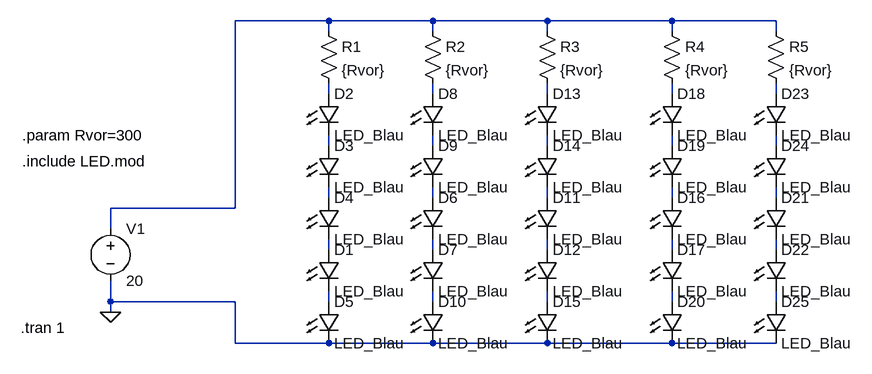
[diagram p0: schematic LED-Strip.asc]
LED-Strip.asc, the LTspice schematic file:
Version 4
SHEET 1 1132 680
WIRE 96 -192 -48 -192
WIRE 256 -192 96 -192
WIRE 432 -192 256 -192
WIRE 624 -192 432 -192
WIRE 784 -192 624 -192
WIRE 96 -176 96 -192
WIRE 256 -176 256 -192
WIRE 432 -176 432 -192
WIRE 624 -176 624 -192
WIRE 784 -176 784 -192
WIRE 96 -80 96 -96
WIRE 256 -80 256 -96
WIRE 432 -80 432 -96
WIRE 624 -80 624 -96
WIRE 784 -80 784 -96
WIRE 96 0 96 -16
WIRE 256 0 256 -16
WIRE 432 0 432 -16
WIRE 624 0 624 -16
WIRE 784 0 784 -16
WIRE 96 80 96 64
WIRE 256 80 256 64
WIRE 432 80 432 64
WIRE 624 80 624 64
WIRE 784 80 784 64
WIRE -48 96 -48 -192
WIRE -48 96 -240 96
WIRE -240 128 -240 96
WIRE 96 160 96 144
WIRE 256 160 256 144
WIRE 432 160 432 144
WIRE 624 160 624 144
WIRE 784 160 784 144
WIRE -240 240 -240 208
WIRE -48 240 -240 240
WIRE 96 240 96 224
WIRE 256 240 256 224
WIRE 432 240 432 224
WIRE 624 240 624 224
WIRE 784 240 784 224
WIRE -240 256 -240 240
WIRE -48 304 -48 240
WIRE 96 304 -48 304
WIRE 256 304 96 304
WIRE 432 304 256 304
WIRE 624 304 432 304
WIRE 784 304 624 304
FLAG -240 256 0
SYMBOL voltage -240 112 R0
WINDOW 123 0 0 Left 2
WINDOW 39 0 0 Left 2
SYMATTR InstName V1
SYMATTR Value 20
SYMBOL LED 80 80 R0
SYMATTR InstName D4
SYMATTR Value LED_Blau
SYMBOL LED 80 160 R0
SYMATTR InstName D1
SYMATTR Value LED_Blau
SYMBOL LED 80 -80 R0
SYMATTR InstName D2
SYMATTR Value LED_Blau
SYMBOL LED 80 0 R0
SYMATTR InstName D3
SYMATTR Value LED_Blau
SYMBOL LED 80 240 R0
SYMATTR InstName D5
SYMATTR Value LED_Blau
SYMBOL res 80 -192 R0
SYMATTR InstName R1
SYMATTR Value {Rvor}
SYMBOL LED 240 80 R0
SYMATTR InstName D6
SYMATTR Value LED_Blau
SYMBOL LED 240 160 R0
SYMATTR InstName D7
SYMATTR Value LED_Blau
SYMBOL LED 240 -80 R0
SYMATTR InstName D8
SYMATTR Value LED_Blau
SYMBOL LED 240 0 R0
SYMATTR InstName D9
SYMATTR Value LED_Blau
SYMBOL LED 240 240 R0
SYMATTR InstName D10
SYMATTR Value LED_Blau
SYMBOL res 240 -192 R0
SYMATTR InstName R2
SYMATTR Value {Rvor}
SYMBOL LED 416 80 R0
SYMATTR InstName D11
SYMATTR Value LED_Blau
SYMBOL LED 416 160 R0
SYMATTR InstName D12
SYMATTR Value LED_Blau
SYMBOL LED 416 -80 R0
SYMATTR InstName D13
SYMATTR Value LED_Blau
SYMBOL LED 416 0 R0
SYMATTR InstName D14
SYMATTR Value LED_Blau
SYMBOL LED 416 240 R0
SYMATTR InstName D15
SYMATTR Value LED_Blau
SYMBOL res 416 -192 R0
SYMATTR InstName R3
SYMATTR Value {Rvor}
SYMBOL LED 608 80 R0
SYMATTR InstName D16
SYMATTR Value LED_Blau
SYMBOL LED 608 160 R0
SYMATTR InstName D17
SYMATTR Value LED_Blau
SYMBOL LED 608 -80 R0
SYMATTR InstName D18
SYMATTR Value LED_Blau
SYMBOL LED 608 0 R0
SYMATTR InstName D19
SYMATTR Value LED_Blau
SYMBOL LED 608 240 R0
SYMATTR InstName D20
SYMATTR Value LED_Blau
SYMBOL res 608 -192 R0
SYMATTR InstName R4
SYMATTR Value {Rvor}
SYMBOL LED 768 80 R0
SYMATTR InstName D21
SYMATTR Value LED_Blau
SYMBOL LED 768 160 R0
SYMATTR InstName D22
SYMATTR Value LED_Blau
SYMBOL LED 768 -80 R0
SYMATTR InstName D23
SYMATTR Value LED_Blau
SYMBOL LED 768 0 R0
SYMATTR InstName D24
SYMATTR Value LED_Blau
SYMBOL LED 768 240 R0
SYMATTR InstName D25
SYMATTR Value LED_Blau
SYMBOL res 768 -192 R0
SYMATTR InstName R5
SYMATTR Value {Rvor}
TEXT -376 24 Left 2 !.include LED.mod
TEXT -378 280 Left 2 !.tran 1
TEXT -376 -16 Left 2 !.param Rvor=300

The netlist it stands for:
* LED-Strip.asc
V1 N001 0 20
D4 N012 N017 LED_Blau
D1 N017 N022 LED_Blau
D2 N002 N007 LED_Blau
D3 N007 N012 LED_Blau
D5 N022 0 LED_Blau
R1 N001 N002 {Rvor}
D6 N013 N018 LED_Blau
D7 N018 N023 LED_Blau
D8 N003 N008 LED_Blau
D9 N008 N013 LED_Blau
D10 N023 0 LED_Blau
R2 N001 N003 {Rvor}
D11 N014 N019 LED_Blau
D12 N019 N024 LED_Blau
D13 N004 N009 LED_Blau
D14 N009 N014 LED_Blau
D15 N024 0 LED_Blau
R3 N001 N004 {Rvor}
D16 N015 N020 LED_Blau
D17 N020 N025 LED_Blau
D18 N005 N010 LED_Blau
D19 N010 N015 LED_Blau
D20 N025 0 LED_Blau
R4 N001 N005 {Rvor}
D21 N016 N021 LED_Blau
D22 N021 N026 LED_Blau
D23 N006 N011 LED_Blau
D24 N011 N016 LED_Blau
D25 N026 0 LED_Blau
R5 N001 N006 {Rvor}
.model D D
.lib standard.dio
.include LED.mod
.tran 1
.param Rvor=300
.backanno
.end